# Altium schematic sheet [01] - COVER PAGE.SchDoc
size A3; DocumentNumber: 1; SheetNumber: 1; SheetTotal: 5
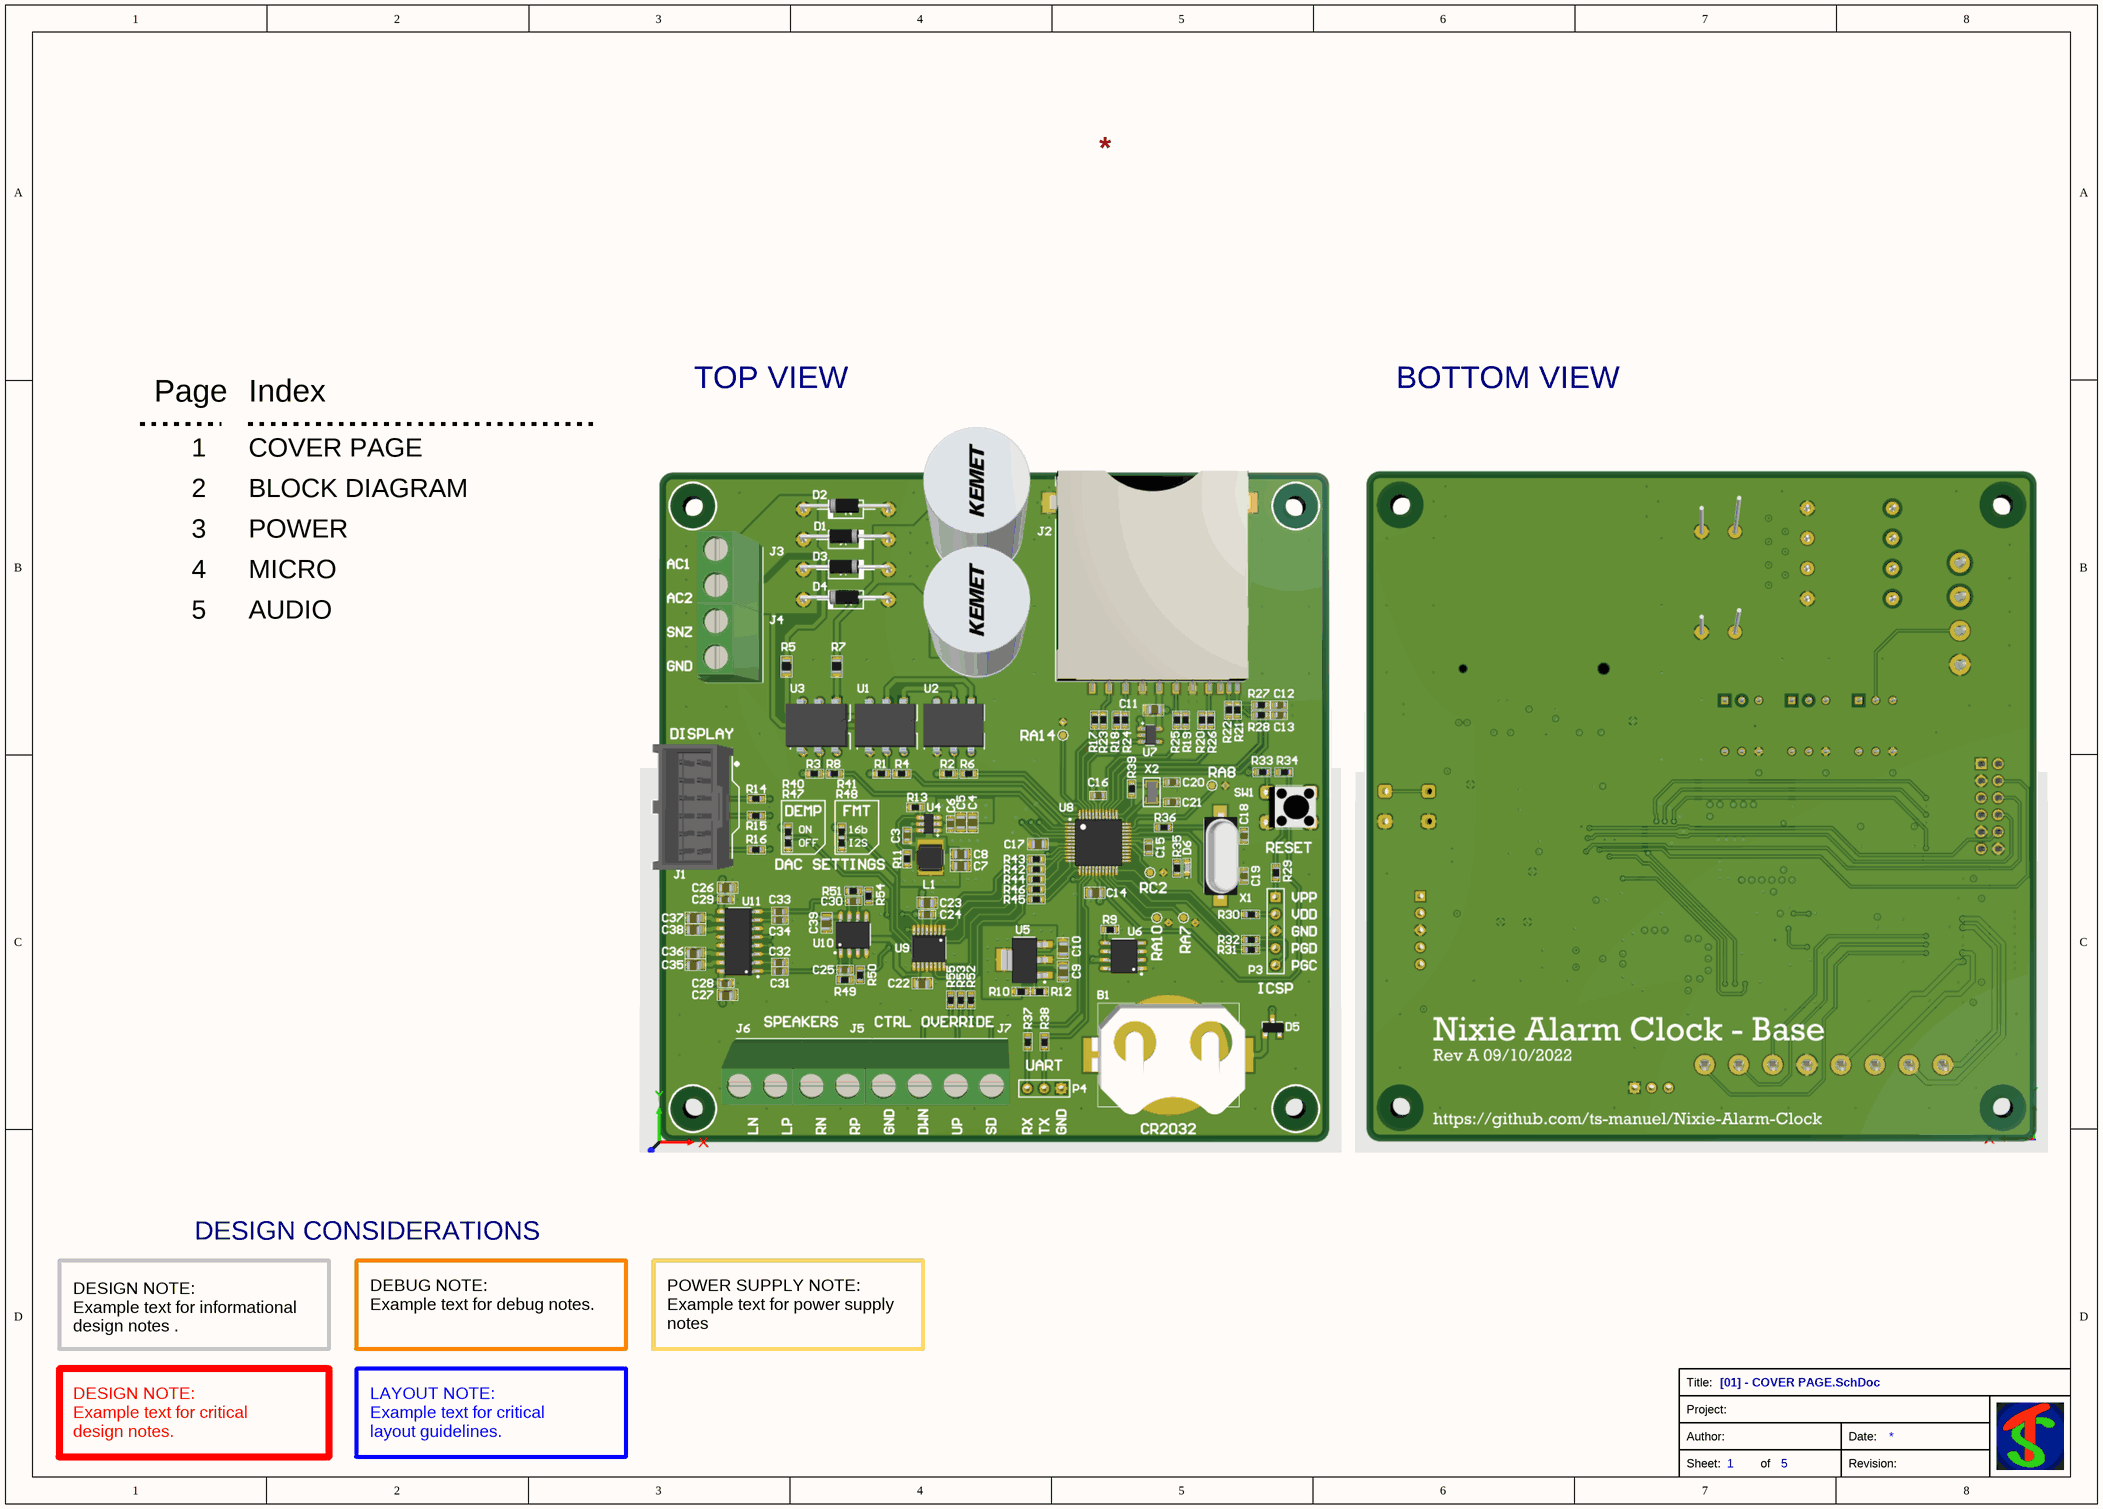
[diagram p0: [01] - COVER PAGE.SchDoc]

## Notes on the sheet
- Page
- Index
- TOP VIEW
- BOTTOM VIEW
- 1
- 2
- COVER PAGE
- BLOCK DIAGRAM
- 3
- 4
- POWER
- MICRO
- 5
- AUDIO
- DESIGN CONSIDERATIONS
- DESIGN NOTE:
  Example text for informational
  design notes .
- DEBUG NOTE:
  Example text for debug notes.
- POWER SUPPLY NOTE:
  Example text for power supply notes
- DESIGN NOTE:
  Example text for critical
  design notes.
- LAYOUT NOTE:
  Example text for critical
  layout guidelines.
- Title:
- Project:
- Sheet:
- Author:
- of
- Revision:
- Date: